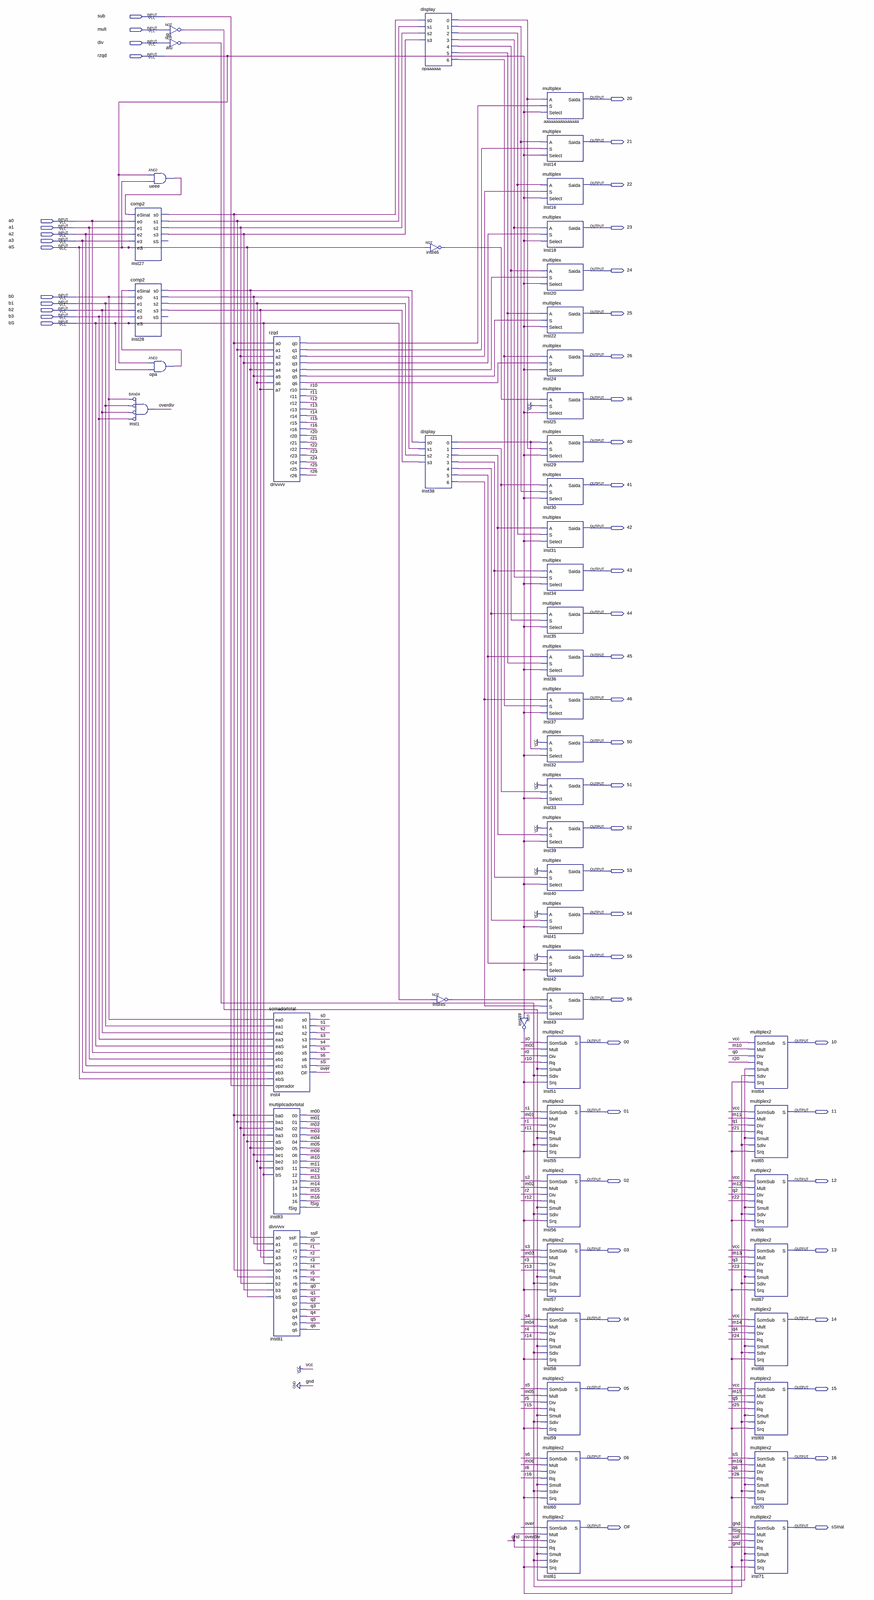
[diagram p0: schematic sheet, whole]
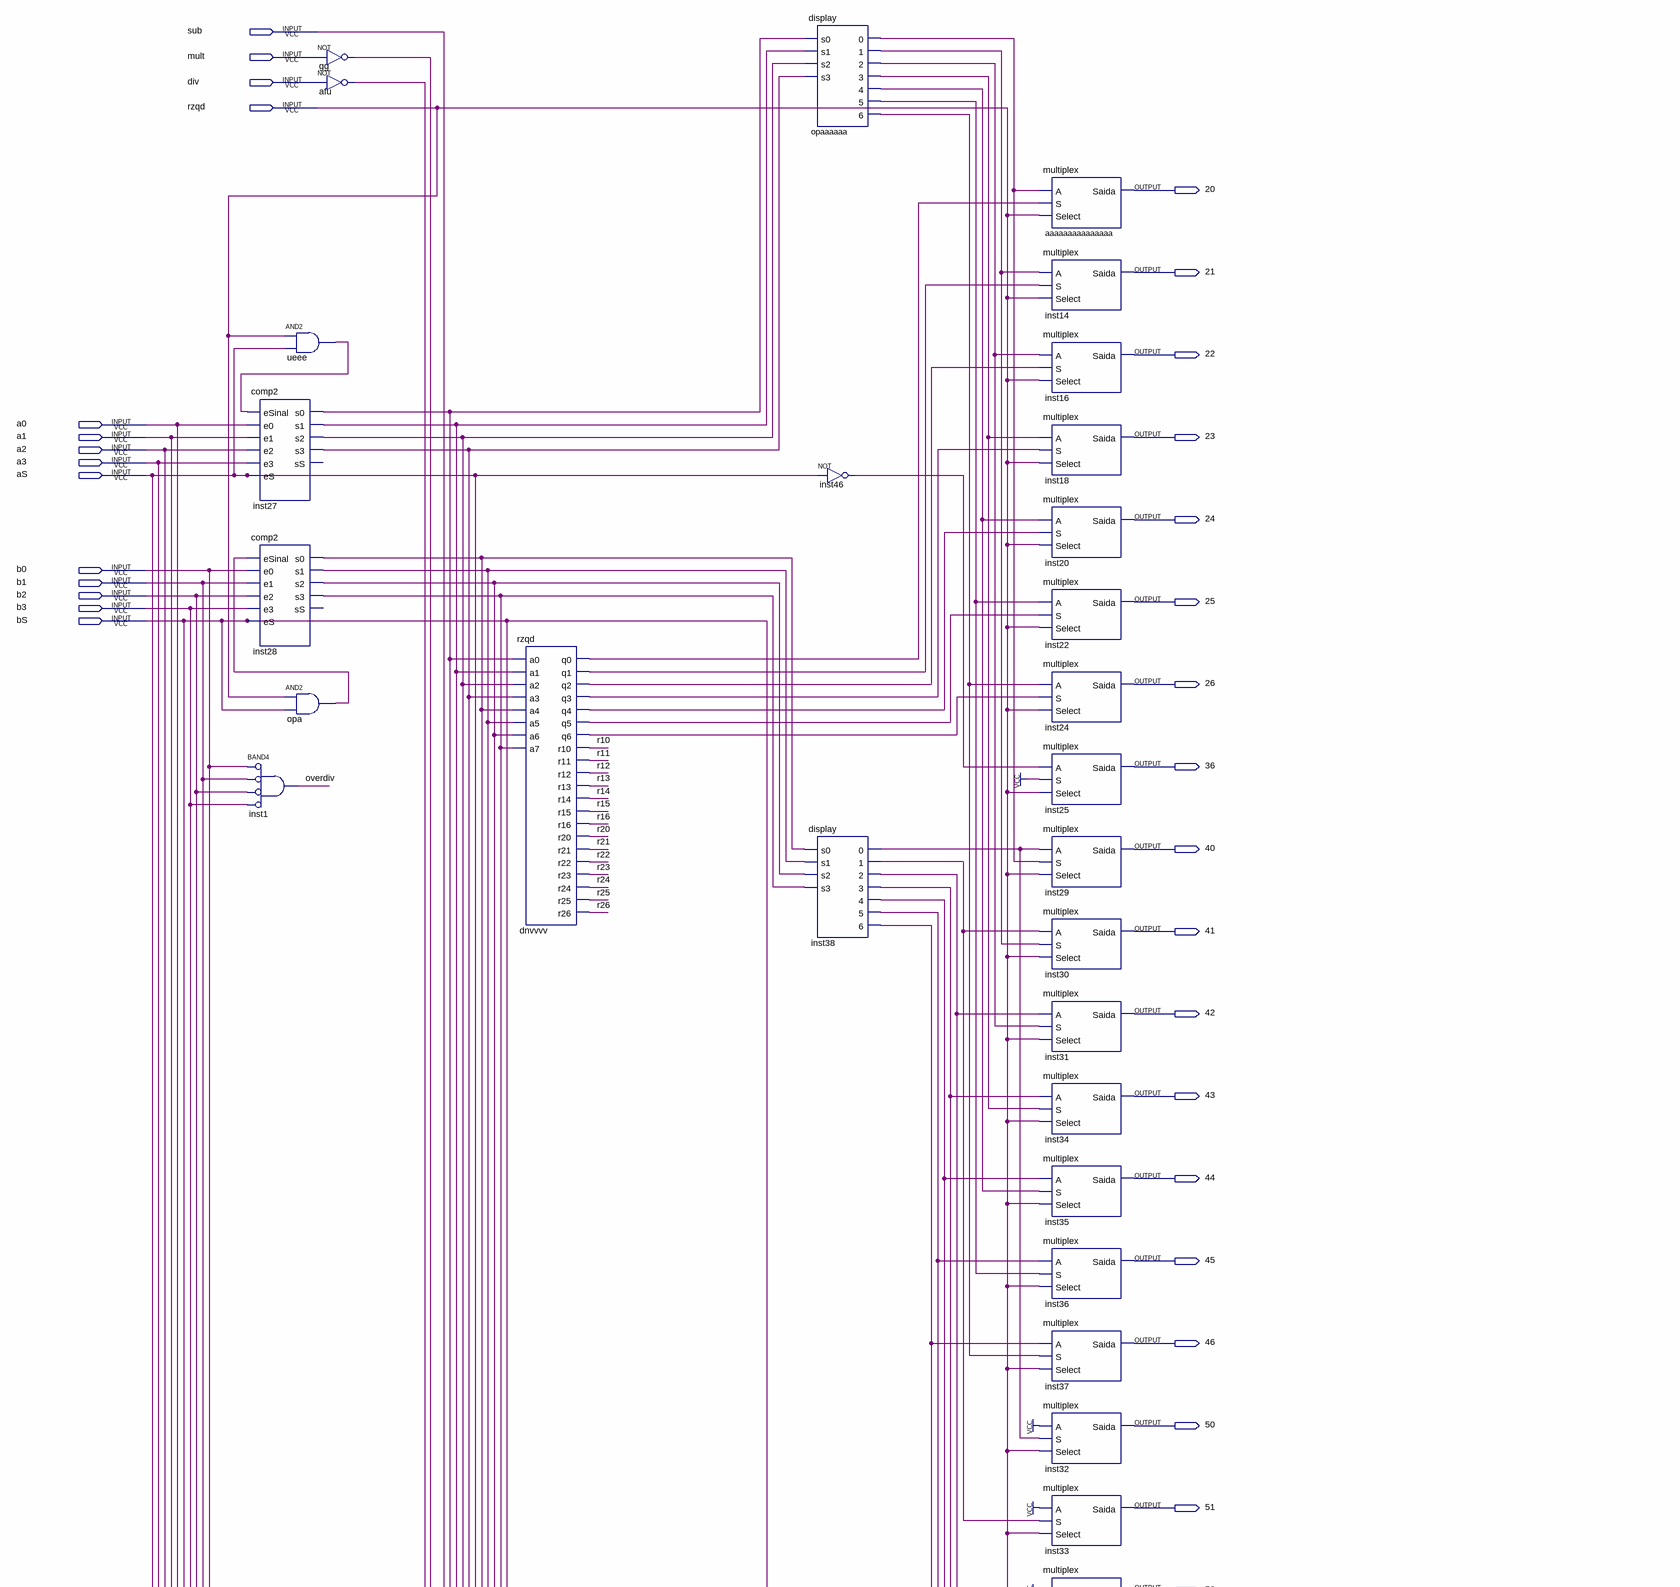
[diagram p1: schematic sheet, upper part]
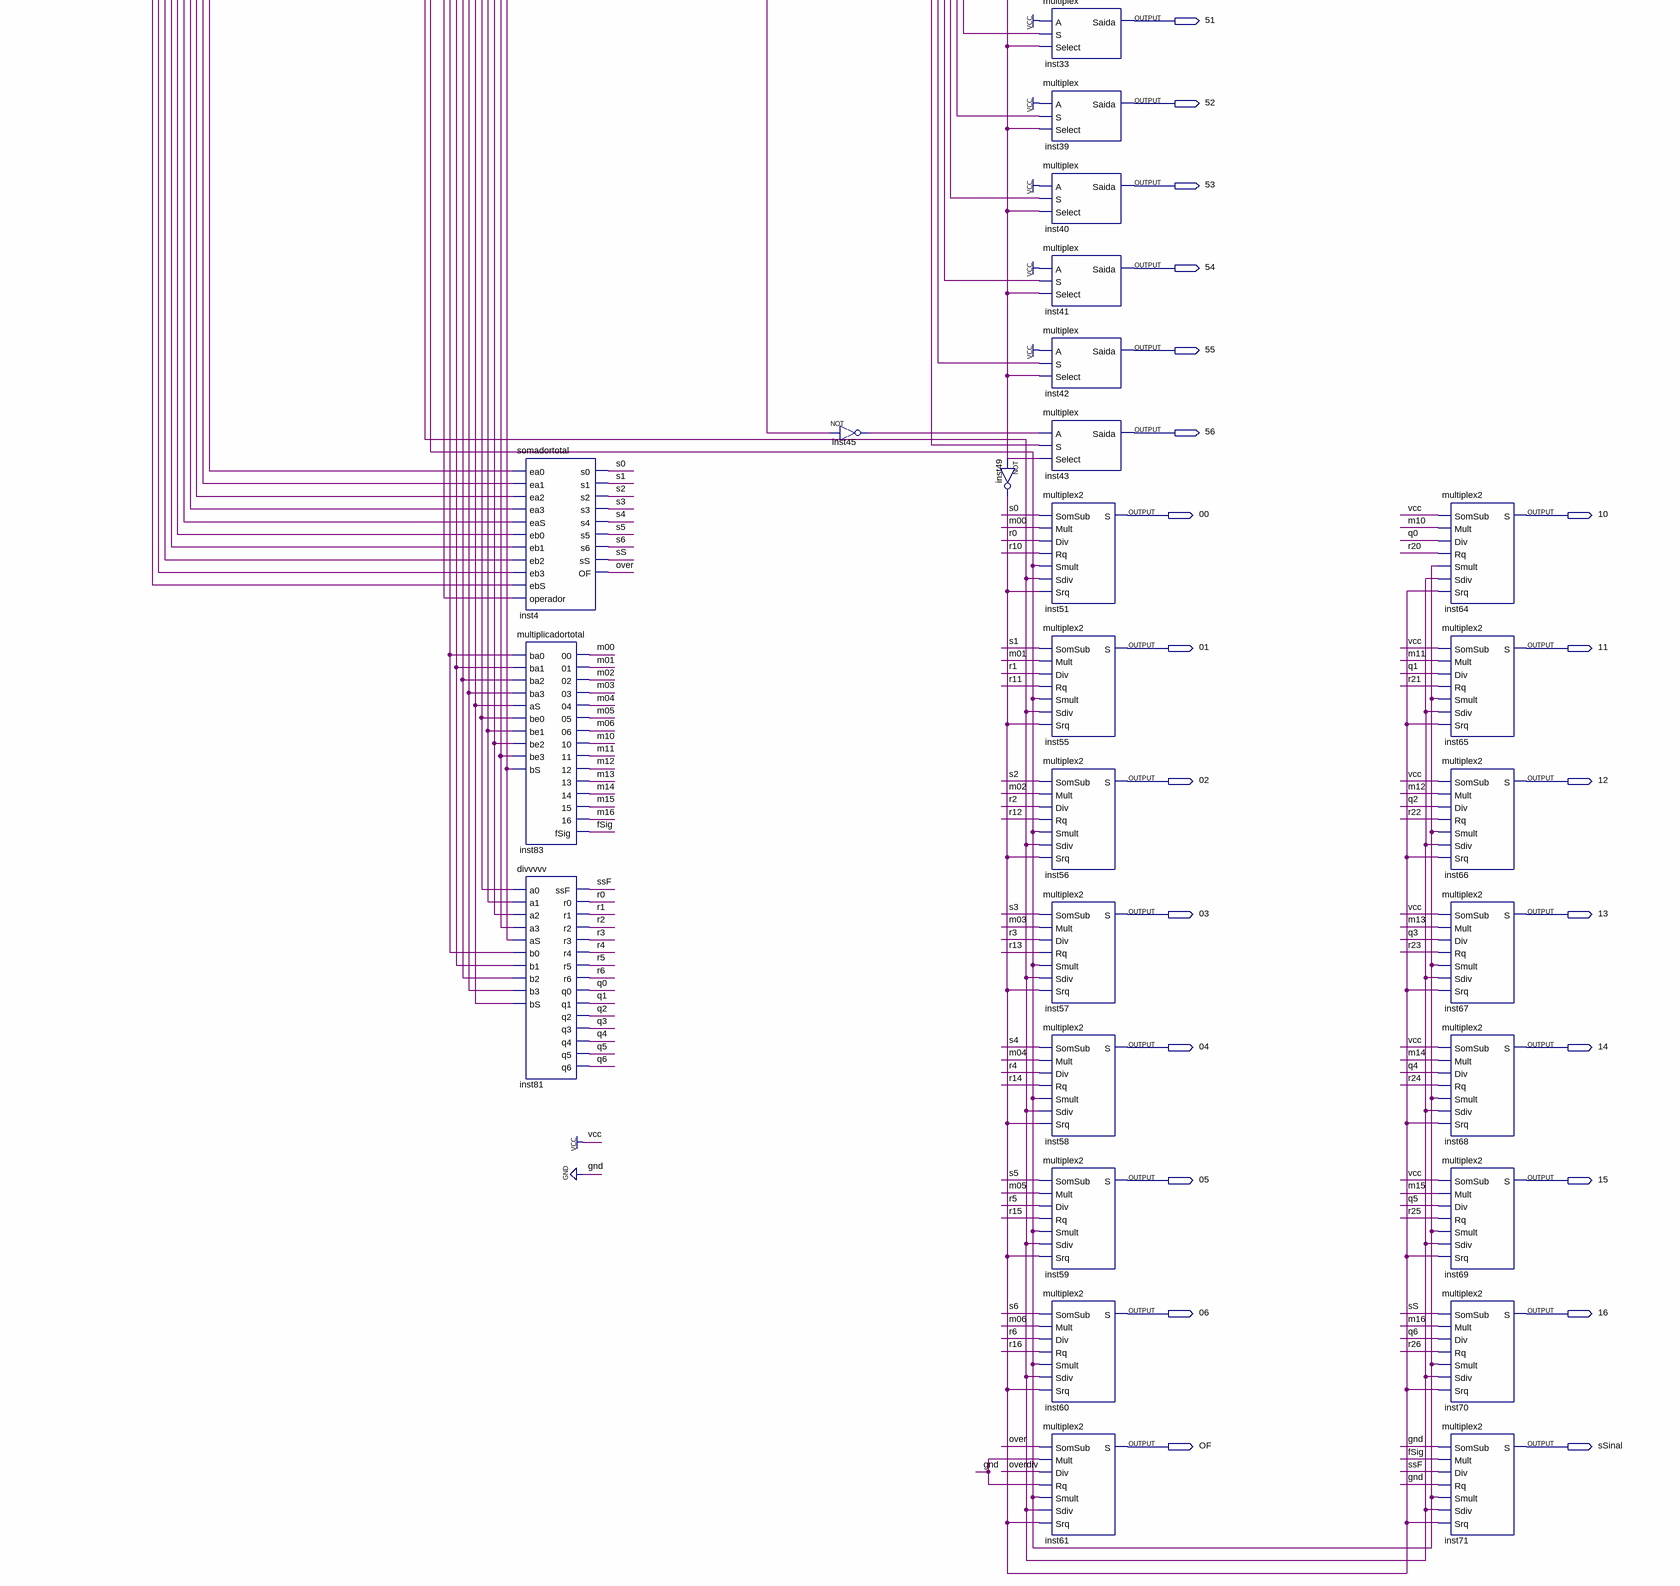
[diagram p2: schematic sheet, lower part]
// Quartus schematic integrado.bdf as structural Verilog: 54 symbols, 52 pins
module integrado (
  input  sub,
  input  mult,
  input  div,
  input  rzqd,
  input  a0,
  input  a1,
  input  a2,
  input  a3,
  input  aS,
  input  b0,
  input  b1,
  input  b2,
  input  b3,
  input  bS,
  output \20 ,
  output \21 ,
  output \22 ,
  output \23 ,
  output \24 ,
  output \25 ,
  output \26 ,
  output \36 ,
  output \40 ,
  output \41 ,
  output \42 ,
  output \43 ,
  output \44 ,
  output \45 ,
  output \46 ,
  output \50 ,
  output \51 ,
  output \52 ,
  output \53 ,
  output \54 ,
  output \55 ,
  output \56 ,
  output \00 ,
  output \10 ,
  output \01 ,
  output \11 ,
  output \02 ,
  output \12 ,
  output \03 ,
  output \13 ,
  output \04 ,
  output \14 ,
  output \05 ,
  output \15 ,
  output \06 ,
  output \16 ,
  output OF,
  output sSinal
);

  wire afu_out, dnvvvv_q0, dnvvvv_q1, dnvvvv_q2, dnvvvv_q3, dnvvvv_q4, dnvvvv_q5, dnvvvv_q6, fSig, gg_out,
       inst27_s0, inst27_s1, inst27_s2, inst27_s3, inst28_s0, inst28_s1, inst28_s2, inst28_s3, inst38_0,
       inst38_1, inst38_2, inst38_3, inst38_4, inst38_5, inst38_6, inst45_out, inst46_out, inst49_out, m00,
       m01, m02, m03, m04, m05, m06, m10, m11, m12, m13, m14, m15, m16, opa_out, opaaaaaa_0, opaaaaaa_1,
       opaaaaaa_2, opaaaaaa_3, opaaaaaa_4, opaaaaaa_5, opaaaaaa_6, over, overdiv, q0, q1, q2, q3, q4, q5, q6,
       r0, r1, r2, r3, r4, r5, r6, r10, r11, r12, r13, r14, r15, r16, r20, r21, r22, r23, r24, r25, r26, s0,
       s1, s2, s3, s4, s5, s6, sS, ssF, ueee_out;

  and ueee (ueee_out, rzqd, aS);
  comp2 inst27 (
    .eSinal(ueee_out), .e0(a0), .e1(a1), .e2(a2), .e3(a3), .eS(aS), .s0(inst27_s0), .s1(inst27_s1),
    .s2(inst27_s2), .s3(inst27_s3));  // open: sS
  comp2 inst28 (
    .eSinal(opa_out), .e0(b0), .e1(b1), .e2(b2), .e3(b3), .eS(bS), .s0(inst28_s0), .s1(inst28_s1),
    .s2(inst28_s2), .s3(inst28_s3));  // open: sS
  and opa (opa_out, rzqd, bS);
  and inst1 (overdiv, ~b0, ~b1, ~b2, ~b3);  // BAND4
  not gg (gg_out, mult);
  not afu (afu_out, div);
  rzqd dnvvvv (
    .a0(inst27_s0), .a1(inst27_s1), .a2(inst27_s2), .a3(inst27_s3), .a4(inst28_s0), .a5(inst28_s1),
    .a6(inst28_s2), .a7(inst28_s3), .q5(dnvvvv_q5), .r15(r15), .q4(dnvvvv_q4), .r14(r14), .q1(dnvvvv_q1),
    .r11(r11), .q2(dnvvvv_q2), .r12(r12), .q0(dnvvvv_q0), .r10(r10), .q6(dnvvvv_q6), .r16(r16),
    .q3(dnvvvv_q3), .r13(r13), .r25(r25), .r24(r24), .r21(r21), .r22(r22), .r20(r20), .r26(r26), .r23(r23));
  somadortotal inst4 (
    .ea0(b0), .ea1(b1), .ea2(b2), .ea3(b3), .eaS(bS), .eb0(a0), .eb1(a1), .eb2(a2), .eb3(a3), .ebS(aS),
    .operador(sub), .s5(s5), .s4(s4), .s1(s1), .s2(s2), .s0(s0), .s6(s6), .s3(s3), .sS(sS), .OF(over));
  multiplicadortotal inst83 (
    .aS(aS), .ba0(inst27_s0), .ba1(inst27_s1), .ba2(inst27_s2), .ba3(inst27_s3), .bS(bS), .be0(inst28_s0),
    .be1(inst28_s1), .be2(inst28_s2), .be3(inst28_s3), .fSig(fSig), .\05 (m05), .\04 (m04), .\01 (m01),
    .\02 (m02), .\00 (m00), .\06 (m06), .\03 (m03), .\15 (m15), .\14 (m14), .\11 (m11), .\12 (m12),
    .\10 (m10), .\16 (m16), .\13 (m13));
  divvvvv inst81 (
    .a0(inst28_s0), .a1(inst28_s1), .a2(inst28_s2), .a3(inst28_s3), .aS(bS), .b0(inst27_s0), .b1(inst27_s1),
    .b2(inst27_s2), .b3(inst27_s3), .bS(aS), .ssF(ssF), .r5(r5), .r4(r4), .r1(r1), .r2(r2), .r0(r0), .r6(r6),
    .r3(r3), .q5(q5), .q4(q4), .q1(q1), .q2(q2), .q0(q0), .q6(q6), .q3(q3));
  display opaaaaaa (
    .s0(inst27_s0), .s1(inst27_s1), .s2(inst27_s2), .s3(inst27_s3), .\5 (opaaaaaa_5), .\4 (opaaaaaa_4),
    .\1 (opaaaaaa_1), .\2 (opaaaaaa_2), .\0 (opaaaaaa_0), .\6 (opaaaaaa_6), .\3 (opaaaaaa_3));
  not inst46 (inst46_out, aS);
  display inst38 (
    .s0(inst28_s0), .s1(inst28_s1), .s2(inst28_s2), .s3(inst28_s3), .\5 (inst38_5), .\4 (inst38_4),
    .\1 (inst38_1), .\2 (inst38_2), .\0 (inst38_0), .\6 (inst38_6), .\3 (inst38_3));
  not inst45 (inst45_out, bS);
  not inst49 (inst49_out, rzqd);
  multiplex aaaaaaaaaaaaaaa (.A(opaaaaaa_0), .S(dnvvvv_q0), .Select(rzqd), .Saida(\20 ));
  multiplex inst14 (.A(opaaaaaa_1), .S(dnvvvv_q1), .Select(rzqd), .Saida(\21 ));
  multiplex inst16 (.A(opaaaaaa_2), .S(dnvvvv_q2), .Select(rzqd), .Saida(\22 ));
  multiplex inst18 (.A(opaaaaaa_3), .S(dnvvvv_q3), .Select(rzqd), .Saida(\23 ));
  multiplex inst20 (.A(opaaaaaa_4), .S(dnvvvv_q4), .Select(rzqd), .Saida(\24 ));
  multiplex inst22 (.A(opaaaaaa_5), .S(dnvvvv_q5), .Select(rzqd), .Saida(\25 ));
  multiplex inst24 (.A(opaaaaaa_6), .S(dnvvvv_q6), .Select(rzqd), .Saida(\26 ));
  multiplex inst25 (.A(inst46_out), .S(1'b1), .Select(rzqd), .Saida(\36 ));
  multiplex inst29 (.A(inst38_0), .S(opaaaaaa_0), .Select(rzqd), .Saida(\40 ));
  multiplex inst30 (.A(inst38_1), .S(opaaaaaa_1), .Select(rzqd), .Saida(\41 ));
  multiplex inst31 (.A(inst38_2), .S(opaaaaaa_2), .Select(rzqd), .Saida(\42 ));
  multiplex inst34 (.A(inst38_3), .S(opaaaaaa_3), .Select(rzqd), .Saida(\43 ));
  multiplex inst35 (.A(inst38_4), .S(opaaaaaa_4), .Select(rzqd), .Saida(\44 ));
  multiplex inst36 (.A(inst38_5), .S(opaaaaaa_5), .Select(rzqd), .Saida(\45 ));
  multiplex inst37 (.A(inst38_6), .S(opaaaaaa_6), .Select(rzqd), .Saida(\46 ));
  multiplex inst32 (.A(1'b1), .S(inst38_0), .Select(rzqd), .Saida(\50 ));
  multiplex inst33 (.A(1'b1), .S(inst38_1), .Select(rzqd), .Saida(\51 ));
  multiplex inst39 (.A(1'b1), .S(inst38_2), .Select(rzqd), .Saida(\52 ));
  multiplex inst40 (.A(1'b1), .S(inst38_3), .Select(rzqd), .Saida(\53 ));
  multiplex inst41 (.A(1'b1), .S(inst38_4), .Select(rzqd), .Saida(\54 ));
  multiplex inst42 (.A(1'b1), .S(inst38_5), .Select(rzqd), .Saida(\55 ));
  multiplex inst43 (.A(inst45_out), .S(inst38_6), .Select(rzqd), .Saida(\56 ));
  multiplex2 inst51 (
    .SomSub(s0), .Mult(m00), .Div(r0), .Rq(r10), .Smult(gg_out), .Sdiv(afu_out), .Srq(inst49_out), .S(\00 ));
  multiplex2 inst55 (
    .SomSub(s1), .Mult(m01), .Div(r1), .Rq(r11), .Smult(gg_out), .Sdiv(afu_out), .Srq(inst49_out), .S(\01 ));
  multiplex2 inst56 (
    .SomSub(s2), .Mult(m02), .Div(r2), .Rq(r12), .Smult(gg_out), .Sdiv(afu_out), .Srq(inst49_out), .S(\02 ));
  multiplex2 inst57 (
    .SomSub(s3), .Mult(m03), .Div(r3), .Rq(r13), .Smult(gg_out), .Sdiv(afu_out), .Srq(inst49_out), .S(\03 ));
  multiplex2 inst58 (
    .SomSub(s4), .Mult(m04), .Div(r4), .Rq(r14), .Smult(gg_out), .Sdiv(afu_out), .Srq(inst49_out), .S(\04 ));
  multiplex2 inst59 (
    .SomSub(s5), .Mult(m05), .Div(r5), .Rq(r15), .Smult(gg_out), .Sdiv(afu_out), .Srq(inst49_out), .S(\05 ));
  multiplex2 inst60 (
    .SomSub(s6), .Mult(m06), .Div(r6), .Rq(r16), .Smult(gg_out), .Sdiv(afu_out), .Srq(inst49_out), .S(\06 ));
  multiplex2 inst61 (
    .SomSub(over), .Mult(1'b0), .Div(overdiv), .Rq(1'b0), .Smult(gg_out), .Sdiv(afu_out), .Srq(inst49_out),
    .S(OF));
  multiplex2 inst64 (
    .SomSub(1'b1), .Mult(m10), .Div(q0), .Rq(r20), .Smult(gg_out), .Sdiv(afu_out), .Srq(inst49_out), .S(\10 ));
  multiplex2 inst65 (
    .SomSub(1'b1), .Mult(m11), .Div(q1), .Rq(r21), .Smult(gg_out), .Sdiv(afu_out), .Srq(inst49_out), .S(\11 ));
  multiplex2 inst66 (
    .SomSub(1'b1), .Mult(m12), .Div(q2), .Rq(r22), .Smult(gg_out), .Sdiv(afu_out), .Srq(inst49_out), .S(\12 ));
  multiplex2 inst67 (
    .SomSub(1'b1), .Mult(m13), .Div(q3), .Rq(r23), .Smult(gg_out), .Sdiv(afu_out), .Srq(inst49_out), .S(\13 ));
  multiplex2 inst68 (
    .SomSub(1'b1), .Mult(m14), .Div(q4), .Rq(r24), .Smult(gg_out), .Sdiv(afu_out), .Srq(inst49_out), .S(\14 ));
  multiplex2 inst69 (
    .SomSub(1'b1), .Mult(m15), .Div(q5), .Rq(r25), .Smult(gg_out), .Sdiv(afu_out), .Srq(inst49_out), .S(\15 ));
  multiplex2 inst70 (
    .SomSub(sS), .Mult(m16), .Div(q6), .Rq(r26), .Smult(gg_out), .Sdiv(afu_out), .Srq(inst49_out), .S(\16 ));
  multiplex2 inst71 (
    .SomSub(1'b0), .Mult(fSig), .Div(ssF), .Rq(1'b0), .Smult(gg_out), .Sdiv(afu_out), .Srq(inst49_out),
    .S(sSinal));
endmodule
